# Altium schematic sheet HIVE_SIGHT_USB.SchDoc
size Tabloid; SheetNumber: 6; SheetTotal: 6; Sheet_Name: USB; Size: 11x17
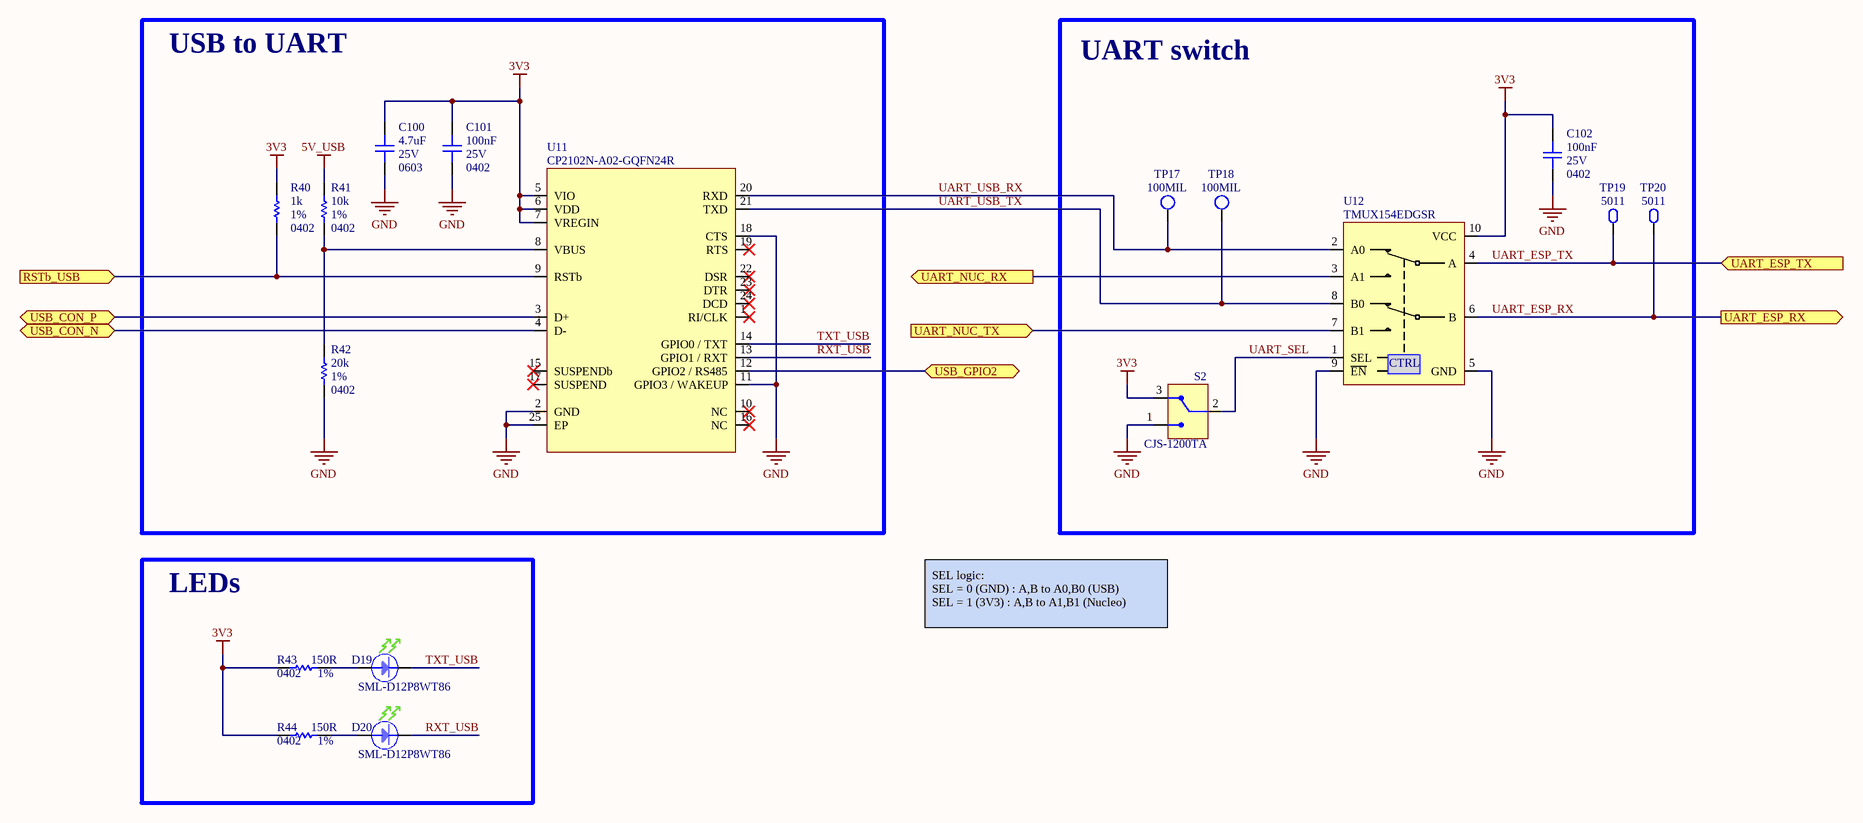
[diagram p0: HIVE_SIGHT_USB.SchDoc]

## Parts
C100  value 4.7uF  Package: 0603  Voltage Rating: 25V  [CAP_CER_0603]  (hidden comment: CL10A475MA8NQNC)
C101  value 100nF  Package: 0402  Voltage Rating: 25V  [CAP_CER_0402]  (hidden comment: CGA2B3X7R1E104K050BB)
C102  value 100nF  Package: 0402  Voltage Rating: 25V  [CAP_CER_0402]  (hidden comment: CGA2B3X7R1E104K050BB)
D19  SML-D12P8WT86  [LED_SML-D12P8WT86]
D20  SML-D12P8WT86  [LED_SML-D12P8WT86]
R40  value 1k  Tolerance: 1%  Package: 0402  [RES_0402]  (hidden comment: RC0402FR-071KL)
R41  value 10k  Tolerance: 1%  Package: 0402  [RES_0402]  (hidden comment: RC0402FR-0710KL)
R42  value 20k  Tolerance: 1%  Package: 0402  [RES_0402]  (hidden comment: RC0402FR-0720KL)
R43  value 150R  Tolerance: 1%  Package: 0402  [RES_0402]  (hidden comment: RC0402FR-07150RL)
R44  value 150R  Tolerance: 1%  Package: 0402  [RES_0402]  (hidden comment: RC0402FR-07150RL)
S2  CJS-1200TA  [SWI_SPDT_CJS-1200TA]
TP17  100MIL  [TPO_TH_ROUND_100MIL]  (no BOM)
TP18  100MIL  [TPO_TH_ROUND_100MIL]  (no BOM)
TP19  5011  [TPO_5011]
TP20  5011  [TPO_5011]
U11  CP2102N-A02-GQFN24R  [COM_XCV_CP2102N-A02-GQFN24R]
U12  TMUX154EDGSR  [LOG_MUX_TMUX154EDGSR]

## Blocks framed on the sheet
USB to UART: C100 C101 R40-R42 U11
UART switch: C102 S2 TP17-TP20 U12
LEDs: D19 D20 R43 R44

## Ports
RSTb_USB (in), UART_ESP_RX (out), UART_ESP_TX (in), UART_NUC_RX (out), UART_NUC_TX (in), USB_CON_N (bidir), USB_CON_P (bidir), USB_GPIO2 (bidir)

## Nets
3V3: C100.2 C101.2 C102.1 R40.1 R43.1 R44.1 S2.3 U11.5(VIO) U11.6(VDD) U11.7(VREGIN) U12.10(VCC)
5V_USB: R41.2
GND: C100.1 C101.1 C102.2 R42.1 S2.1 U11.2(GND) U11.11(GPIO3_/_WAKEUP) U11.18(CTS) U11.25(EP) U12.5(GND) U12.9(~{EN})
RSTb_USB: R40.2 U11.9(RSTb) ; port RSTb_USB
RXT_USB: D20.K U11.13(GPIO1_/_RXT)
TXT_USB: D19.K U11.14(GPIO0_/_TXT)
UART_ESP_RX: TP20.1 U12.6(B) ; port UART_ESP_RX
UART_ESP_TX: TP19.1 U12.4(A) ; port UART_ESP_TX
UART_NUC_RX: U12.3(A1) ; port UART_NUC_RX
UART_NUC_TX: U12.7(B1) ; port UART_NUC_TX
UART_SEL: S2.2 U12.1(SEL)
UART_USB_RX: TP17.1 U11.20(RXD) U12.2(A0)
UART_USB_TX: TP18.1 U11.21(TXD) U12.8(B0)
USB_CON_N: U11.4(D-) ; port USB_CON_N
USB_CON_P: U11.3(D+) ; port USB_CON_P
USB_GPIO2: U11.12(GPIO2_/_RS485) ; port USB_GPIO2
NetD19_A: D19.A R43.2
NetD20_A: D20.A R44.2
NetR41_1: R41.1 R42.2 U11.8(VBUS)

Not connected (* = marked no-connect by the designer): U11 1(RI/CLK)* 10(NC)* 15(SUSPENDb)* 16(NC)* 17(SUSPEND)* 19(RTS)* 22(DSR)* 23(DTR)* 24(DCD)*

## Notes on the sheet
- SEL logic:
  SEL = 0 (GND) : A,B to A0,B0 (USB)
  SEL = 1 (3V3) : A,B to A1,B1 (Nucleo)
- Sheet Name
- Project Title
- Global Project
- Size
- Group
- Revision
- Date
- Sheet
- of
- Filename
- Designers
- (in symbol LOG_MUX_TMUX154EDGSR) CTRL

## Library data of the parts
C100 = CAP_CER_CL10A475MA8NQNC: CAP - CER 4.7µF 20% 25V X5R - 0603; Manufacturer #1: Samsung Electro-Mechanics; GRAMS Lib Spec: 2.8; Magnetic Material: Unknown; Polarized: NO; Assembly Type: SMD; CreatedBy/Date: Nicolas Roy 2018-11-21; Current Rating: *; HelpURL: http://www.samsungsem.com/kr/support/product-search/mlcc/__icsFiles/afieldfile/2018/06/20/CL10A475MA8NQNC.pdf; Manufacturer #2: *; Note: *; Part Number #1: CL10A475MA8NQNC; Part Number #2: *; Power Max: *; Temperature: -55°C ~ 85°C; Tolerance: 20%; VerifiedBy: Nicolas V. (2019-01-22); Supplier 1: Digi-Key; Supplier Part Number 1: 1276-1903-1-ND
C101 C102 = CAP_CER_CGA2B3X7R1E104K050BB: CAP - CER 0.1µF 10% 25V X7R - 0402; Manufacturer #1: TDK Corporation; GRAMS Lib Spec: 2.8; Magnetic Material: Unknown; Polarized: NO; Assembly Type: SMD; CreatedBy/Date: Nicolas Roy 2018-11-07; Current Rating: *; HelpURL: https://product.tdk.com/info/en/catalog/datasheets/mlcc_automotive_general_en.pdf; Manufacturer #2: *; Note: *; Part Number #1: CGA2B3X7R1E104K050BB; Part Number #2: *; Power Max: *; Temperature: -55°C ~ 125°C; Tolerance: 10%; VerifiedBy: Nicolas V. (2019-01-22); Supplier 1: Digi-Key; Supplier Part Number 1: 445-6902-1-ND; Cryo: UNKNOWN
D19 D20 = LED_SML-D12P8WT86: LED - GREEN DIFFUSED 0603 SMD - 0603; Manufacturer #1: Rohm Semiconductor; Current Rating: 1-20mA; Note: Operate at 2mA; Value: 560 nm (green); Voltage rating: 2.2V (Forward), 5V (max Reverse); Polarized: Yes; Magnetic Material: Unknown; GRAMS Lib Spec: 2.8; Manufacturer #2: *; Power Max: *; Part Number #1: SML-D12P8WT86; Part Number #2: *; HelpURL: https://d1d2qsbl8m0m72.cloudfront.net/en/products/databook/datasheet/opto/led/chip_mono/sml-d12x8_d13x8-e.pdf; Supplier 1: Digi-Key; Supplier Part Number 1: 511-1579-2-ND; Assembly Type: SMD; Temperature: -40 ~ 85 °C; Package: 0603; CreatedBy/Date: Keven Deslandes - 2018/11/21; Tolerance: *; VerifiedBy: Caroline Paulin - 13 février 2019; Cryo: UNKNOWN
R40 = RES_RC0402FR-071KL: RES - 1K OHM 1% 1/16W - 0402; Manufacturer #1: Yageo; GRAMS Lib Spec: 2.8; Magnetic Material: YES; Polarized: NO; Voltage Rating: 50V; Cryo: UNKNOWN; Assembly Type: SMD; CreatedBy/Date: Jonathan Bouchard 2018-07-05; Current Rating: *; HelpURL: http://www.yageo.com/documents/recent/PYu-RC_Group_51_RoHS_L_9.pdf; Manufacturer #2: *; Note: *; Part Number #1: RC0402FR-071KL; Part Number #2: *; Power Max: 1/16W; Temperature: -55°C ~ 155°C; VerifiedBy: Arnaud Samson 16-07-18; Supplier 1: Digi-Key; Supplier Part Number 1: 311-1.00KLRCT-ND
R41 = RES_RC0402FR-0710KL: RES - 10K OHMS 1% 1/16W - 0402; Manufacturer #1: Yageo; GRAMS Lib Spec: 2.8; Magnetic Material: UNKNOWN; Polarized: NO; Voltage Rating: 50V; Assembly Type: SMD; CreatedBy/Date: Nicolas V. (2018-11-20); Current Rating: *; HelpURL: http://www.yageo.com/documents/recent/PYu-RC_Group_51_RoHS_L_9.pdf; Manufacturer #2: *; Note: *; Part Number #1: RC0402FR-0710KL; Part Number #2: *; Power Max: 1/16W; Temperature: -55°C ~ 155°C; VerifiedBy: Nicolas V. (2018-11-20); Supplier 1: Digi-Key; Supplier Part Number 1: 311-10.0KLRCT-ND; Cryo: UNKNOWN
R42 = RES_RC0402FR-0720KL: RES - 20K 1% 1/16W  - 0402; Manufacturer #1: Yageo; GRAMS Lib Spec: 2.8; Magnetic Material: Unknown; Polarized: No; Voltage Rating: 50V; Assembly Type: SMD; CreatedBy/Date: Keven Deslandes 2018-10-18; Current Rating: *; HelpURL: http://www.yageo.com/documents/recent/PYu-RC_Group_51_RoHS_L_10.pdf; Manufacturer #2: *; Note: *; Part Number #1: RC0402FR-0720KL; Part Number #2: *; Power Max: 1/16W; Temperature: -55°C ~ 155°C; VerifiedBy: Caroline Paulin - 7 janv 2019; Supplier 1: Digi-Key; Supplier Part Number 1: 311-20.0KLRCT-ND; Cryo: UNKNOWN
R43 R44 = RES_RC0402FR-07150RL: RES - 150R 1% 1/16W - 0402; Manufacturer #1: Yageo; GRAMS Lib Spec: 2.8; Magnetic Material: Unknown; Polarized: No; Voltage Rating: 50V; Assembly Type: SMD; CreatedBy/Date: Jonathan Bouchard 2019-03-25; Current Rating: *; HelpURL: http://www.yageo.com/documents/recent/PYu-RC_Group_51_RoHS_L_10.pdf; Manufacturer #2: *; Part Number #1: RC0402FR-07150RL; Part Number #2: *; Power Max: 1/16W; Temperature: -55°C ~ 155°C; VerifiedBy: Nicolas V. (2019-05-02); Supplier 1: Digi-Key; Supplier Part Number 1: 311-150LRCT-ND; Cryo: UNKNOWN
S2 = SWI_SPDT_CJS-1200TA: SWI - SLIDE SPDT 100MA 6V - SMD; Manufacturer #1: Nidec Copal Electronics; GRAMS Lib Spec: 2.8; Magnetic Material: Unknown; Polarized: yes; Value: SPDT; Tolerance: -; Voltage Rating: 6V; Current Rating: 100mA; Power Max: -; HelpURL: https://www.nidec-copal-electronics.com/e/catalog/switch/cjs.pdf; CreatedBy/Date: Caroline Paulin - 15/11/2018; VerifiedBy: Nicolas V. (2018-11-16); Temperature: -40°C ~ 85°C; Package: SMD; Manufacturer #2: -; Assembly Type: SMD; Part Number #2: -; Part Number #1: CJS-1200TA; Supplier 1: Digi-Key; Supplier Part Number 1: 563-1021-1-ND
TP17 TP18 = TPO_TH_ROUND_100MIL: TPO - TEST POINT ROUND TH  - 100MIL; Magnetic Material: NO; GRAMS Lib Spec: 2.8c; Cryo: UNKNOWN; Current Rating: *; Manufacturer #1: *; Manufacturer #2: *; Note: *; Power Max: *; Value: *; Part Number #1: *; Part Number #2: *; HelpURL: *; Polarized: *; Supplier 1: *; Assembly Type: NONE; Supplier Part Number 1: *; Package: 100 MIL round; CreatedBy/Date: Louis-Daniel Gaulin/ 14/01/2020; Temperature: *; Tolerance: *; VerifiedBy: C.Paulin - 21/01/2020; Voltage Rating: *
TP19 TP20 = TPO_5011: TPO - TEST POINT - TH; Manufacturer #1: Keystone Electronics; Polarized: No; Magnetic Material: UNKNOWN; GRAMS Lib Spec: 2.8; Current Rating: *; Manufacturer #2: *; Note: *; Power Max: *; Value: *; Part Number #1: 5011; Part Number #2: *; HelpURL: https://www.keyelco.com/userAssets/file/M65p56.pdf; Assembly Type: TH; Package: *; CreatedBy/Date: Louis-Daniel Gauli / 02-11-2020; Temperature: *; Tolerance: *; VerifiedBy: Philippe Arsenault/2020-11-06; Voltage Rating: *; Cryo: UNKNOWN; Supplier 1: Digi-Key
U11 = COM_XCV_CP2102N-A02-GQFN24R: COM_XCV - IC USB TO UART BRIDGE - 24-QFN (4x4); Manufacturer #1: Silicon Labs; Voltage Rating: 3V ~ 3.6V; Current Rating: 9.5mA; Power Max: 35mW; GRAMS Lib Spec: 2.8c; Magnetic Material: Unknown; Polarized: YES; Value: -; Tolerance: -; HelpURL: https://www.silabs.com/documents/public/data-sheets/cp2102n-datasheet.pdf; CreatedBy/Date: Louis-Daniel Gaulin / 06-10-2020; VerifiedBy: Philippe Arsenault/2020-11-06; Temperature: -40°C ~ 85°C (TA); Package: 24-QFN (4x4); Manufacturer #2: -; Note: -; Assembly Type: SMD; Part Number #2: -; Part Number #1: CP2102N-A02-GQFN24R; Supplier 1: Digi-Key; Supplier Part Number 1: 336-5888-1-ND
U12 = LOG_MUX_TMUX154EDGSR: LOG_MUX -  SWITCH SPDT DUAL 2:1 - 10-VSSOP; Manufacturer #1: Texas Instruments; Voltage Rating: 3V ~ 4.3V; Current Rating: 10uA; Power Max: 50uW; GRAMS Lib Spec: 2.8C; Magnetic Material: Unknown; Polarized: YES; Value: -; Tolerance: -; HelpURL: https://www.ti.com/lit/ds/symlink/tmux154e.pdf?HQS=TI-null-null-digikeymode-df-pf-null-wwe&ts=1602037764538; CreatedBy/Date: Louis-Daniel Gaulin / 06-10-2020; VerifiedBy: Philippe Arsenault/2020-11-06; Temperature: -40°C ~ 85°C; Package: 10-VSSOP; Manufacturer #2: -; Note: -; Assembly Type: SMD; Part Number #2: -; Part Number #1: TMUX154EDGSR; Supplier 1: Digi-Key; Supplier Part Number 1: 296-48347-1-ND